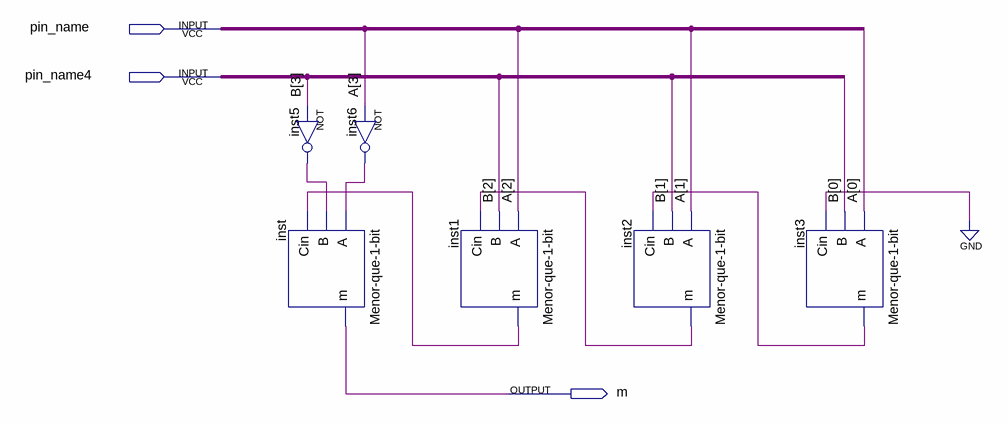
[diagram p0: schematic sheet]
// Quartus schematic Menor-que-4-bits.bdf as structural Verilog: 6 symbols, 3 pins
module \Menor-que-4-bits  (
  input  pin_name,
  input  pin_name4,
  output m
);

  wire inst1_m, inst2_m, inst3_m, inst5_out, inst6_out;
  wire [3:0] A, B;

  not inst5 (inst5_out, B[3]);
  \Menor-que-1-bit  inst (.A(inst6_out), .B(inst5_out), .Cin(inst1_m), .m(m));
  not inst6 (inst6_out, A[3]);
  \Menor-que-1-bit  inst1 (.A(A[2]), .B(B[2]), .Cin(inst2_m), .m(inst1_m));
  \Menor-que-1-bit  inst2 (.A(A[1]), .B(B[1]), .Cin(inst3_m), .m(inst2_m));
  \Menor-que-1-bit  inst3 (.A(A[0]), .B(B[0]), .Cin(1'b0), .m(inst3_m));
endmodule
